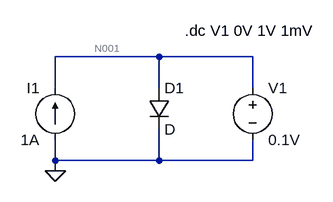
[diagram p0: schematic PV-cell_too_simple_V001.asc]
PV-cell_too_simple_V001.asc, the LTspice schematic file:
Version 4
SHEET 1 880 680
WIRE 256 80 96 80
WIRE 400 80 256 80
WIRE 96 128 96 80
WIRE 256 128 256 80
WIRE 400 128 400 80
WIRE 96 240 96 208
WIRE 256 240 256 192
WIRE 256 240 96 240
WIRE 400 240 400 208
WIRE 400 240 256 240
WIRE 96 256 96 240
FLAG 96 256 0
SYMBOL current 96 208 R180
WINDOW 0 24 80 Left 2
WINDOW 3 24 0 Left 2
WINDOW 123 0 0 Left 0
WINDOW 39 0 0 Left 0
SYMATTR InstName I1
SYMATTR Value 1A
SYMBOL diode 240 128 R0
SYMATTR InstName D1
SYMBOL voltage 400 112 R0
WINDOW 123 0 0 Left 0
WINDOW 39 0 0 Left 0
SYMATTR InstName V1
SYMATTR Value 0.1V
TEXT 296 40 Left 2 !.dc V1 0V 1V 1mV

The netlist it stands for:
* PV-cell_too_simple_V001.asc
I1 0 N001 1A
D1 N001 0 D
V1 N001 0 0.1V
.model D D
.lib standard.dio
.dc V1 0V 1V 1mV
.backanno
.end

* Results of the author's LTspice run, read from the files saved beside the schematic
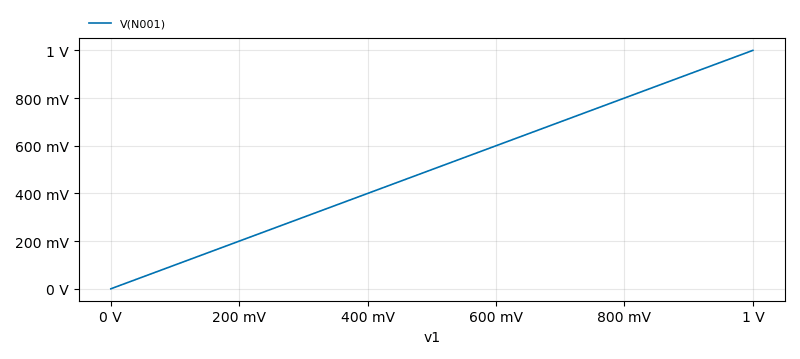
[diagram p1: DC transfer characteristic of PV-cell_too_simple_V001.asc, plotted from the saved traces]
* DC transfer characteristic, 1 run:
*   V(N001): 0 V at v1=0 V, 1 V at v1=1 V, min 0 V, max 1 V